# Altium schematic sheet Sine Filter.SchDoc
size A4
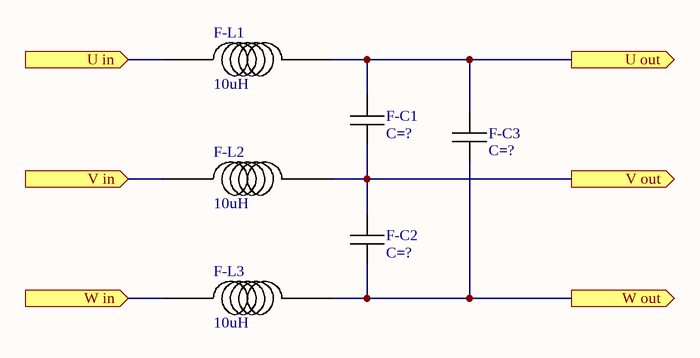
[diagram p0: Sine Filter.SchDoc]

## Parts
F-C1  C=?
F-C2  C=?
F-C3  C=?
F-L1  10uH  [Header 1x2+1 1.0mm]
F-L2  10uH  [Header 1x2+1 1.0mm]
F-L3  10uH  [Header 1x2+1 1.0mm]

## Ports
U in (in), U out (out), V in (in), V out (out), W in (in), W out (out)

## Nets
U in: F-L1.1 ; port U in
U out: F-C1.1 F-C3.1 F-L1.2 ; port U out
V in: F-L2.1 ; port V in
V out: F-C1.2 F-C2.1 F-L2.2 ; port V out
W in: F-L3.1 ; port W in
W out: F-C2.2 F-C3.2 F-L3.2 ; port W out

## Library data of the parts
F-C1-F-C3 = Capacitor
F-L1-F-L3 = Coil